# Altium schematic sheet POWER.SchDoc
size 199 x 100 mm
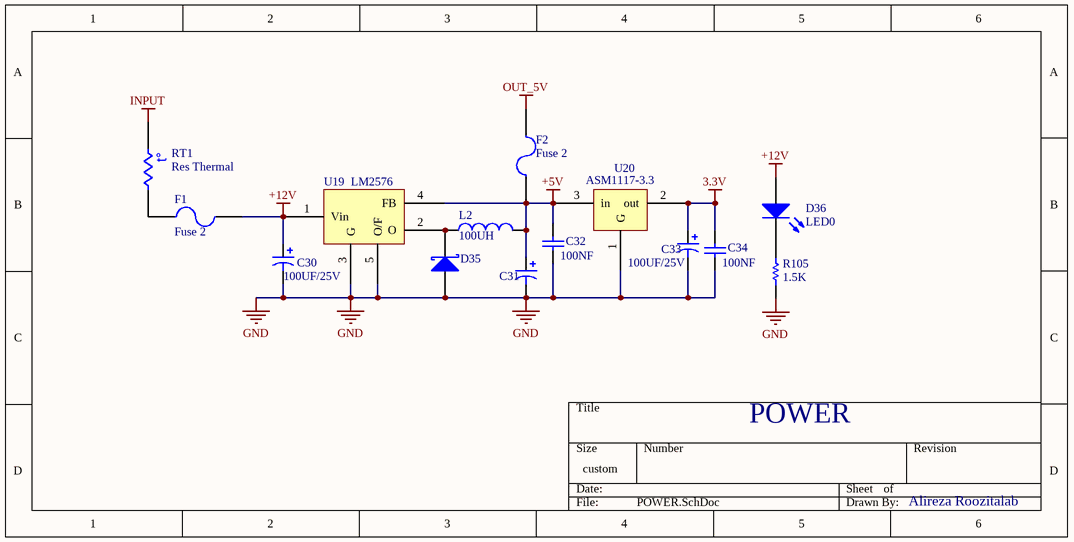
[diagram p0: POWER.SchDoc]

## Parts
C30  value 100UF/25V  [POL 220U/35V]  (hidden comment: Cap Pol1)
C31  Cap Pol1  [POL 220U/35V]  (value not drawn)
C32  value 100NF  [REC 10N]  (hidden comment: Cap)
C33  value 100UF/25V  [POL 100U/25V]  (hidden comment: Cap Pol1)
C34  value 100NF  [REC 10N]  (hidden comment: Cap)
D35  D Schottky  [DO214AC]  (value not drawn)
D36  LED0  [led-1206]
F1  Fuse 2  [fuse plastic holder]
F2  Fuse 2  [fuse plastic holder]
L2  value 100UH  [TR]  (hidden comment: Inductor)
R105  value 1.5K  [RES 1206 (3216X08L)]  (hidden comment: Res1)
RT1  Res Thermal  [Varistor Short Hieght - Vertical]
U19  LM2576  [d2pak5-lead]
U20  ASM1117-3.3  [SOT-223]

## Nets
3.3V: C33.1 C34.2 U20.2(out)
+5V: C31.1 C32.2 F2.1 L2.2 U19.4(FB) U20.3(in)
+12V: C30.1 D36.1(A) F1.2 U19.1(Vin)
GND: C30.2 C31.2 C32.1 C33.2 C34.1 D35.1(A) R105.1 U19.3(G) U19.5(O/F) U20.1(G)
INPUT: RT1.1
OUT_5V: F2.2
NetD35_2: D35.2(K) L2.1 U19.2(O)
NetD36_2: D36.2(K) R105.2
NetF1_1: F1.1 RT1.2

## Notes on the sheet
- POWER
- Alireza Roozitalab
- (in symbol Res Thermal) t°

## Library data of the parts
C30 C33 = Cap Pol1: Polarized Capacitor (Radial); Published: 8-Jun-2000; LatestRevisionDate: 17-Jul-2002; LatestRevisionNote: Re-released for DXP Platform.; PackageReference: RB7.6-15; Publisher: Altium Limited
C31 = Cap Pol1: Polarized Capacitor (Radial); Value: 100UF/25v; Published: 8-Jun-2000; LatestRevisionDate: 17-Jul-2002; LatestRevisionNote: Re-released for DXP Platform.; PackageReference: RB7.6-15; Publisher: Altium Limited
C32 C34 = Cap: Capacitor; Published: 8-Jun-2000; LatestRevisionDate: 17-Jul-2002; LatestRevisionNote: Re-released for DXP Platform.; PackageReference: RAD-0.3; Publisher: Altium Limited
D35 = D Schottky: Schottky Diode; Published: 8-Jun-2000; LatestRevisionDate: 17-Jul-2002; LatestRevisionNote: Re-released for DXP Platform.; PackageReference: SMB; Publisher: Altium Limited; Code_JEDEC: DO-214-AA
D36 = LED0: Typical INFRARED GaAs LED; Published: 8-Jun-2000; LatestRevisionDate: 08-Jul-2005; LatestRevisionNote: Mech Layer 1 removed.; PackageReference: LED-0; Publisher: Altium Limited
F1 F2 = Fuse 2: Fuse; Published: 8-Jun-2000; LatestRevisionDate: 17-Jul-2002; LatestRevisionNote: Re-released for DXP Platform.; PackageReference: PIN-W2/E2.8; Publisher: Altium Limited
L2 = Inductor: Code_IEC: 1005; Published: 8-Jun-2000; LatestRevisionDate: 17-Jul-2002; LatestRevisionNote: Re-released for DXP Platform.; PackageReference: 0402-A; Publisher: Altium Limited; Code_JEITA: 0402
R105 = Res1: Resistor; Published: 8-Jun-2000; LatestRevisionDate: 17-Jul-2002; LatestRevisionNote: Re-released for DXP Platform.; PackageReference: AXIAL-0.3; Publisher: Altium Limited
RT1 = Res Thermal: Thermistor; Published: 24-Mar-1999; LatestRevisionDate: 04-Mar-2005; LatestRevisionNote: PCB Footprint replaced.; PackageReference: 6-0805; Publisher: Altium Limited
U19 = LM2576-5V